# EAGLE design Suport 0.1 (EAGLE 9.6.2)
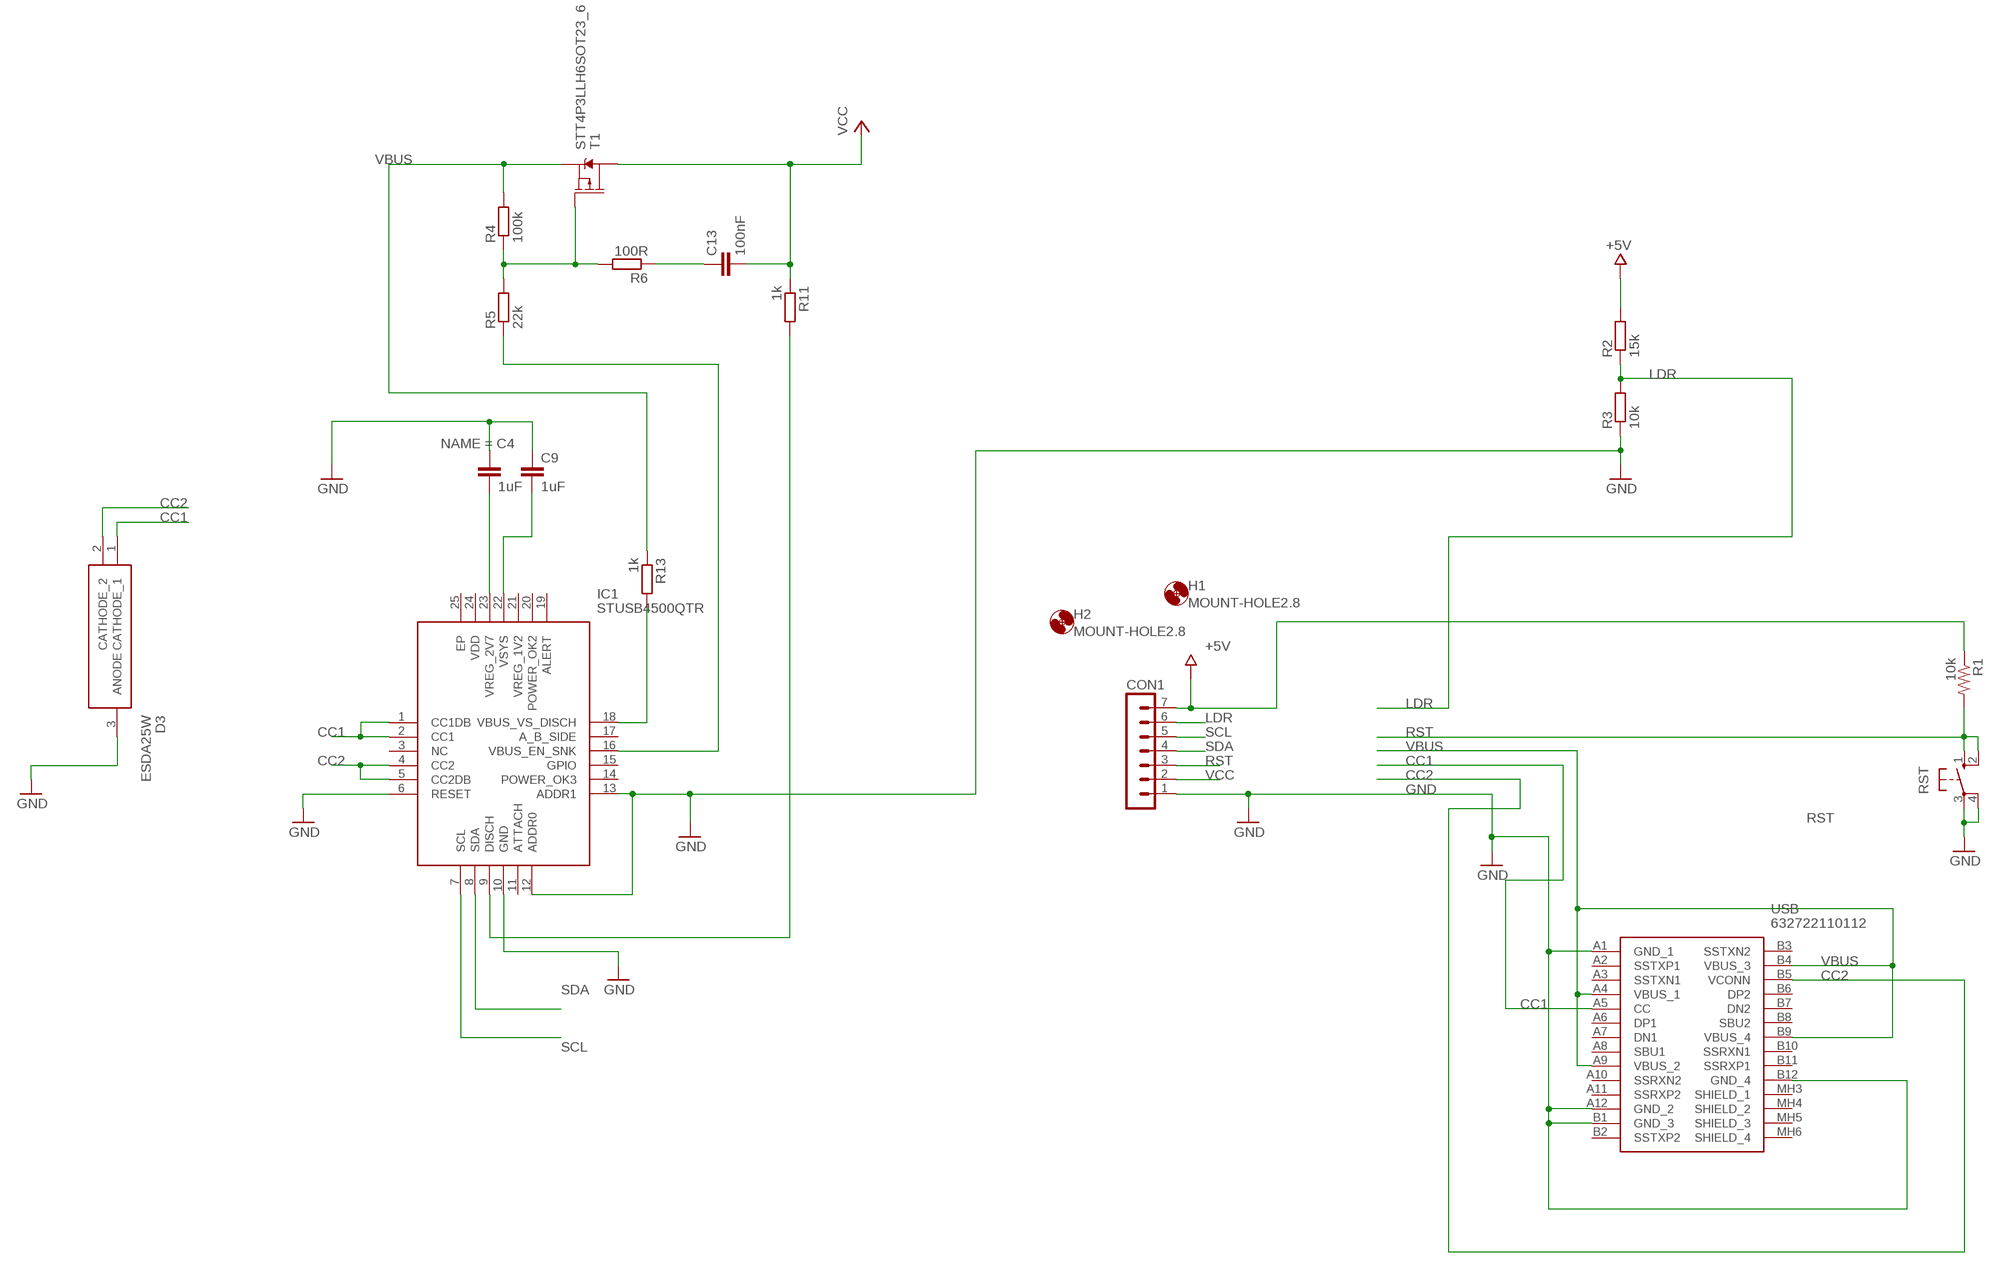
[diagram p0: schematic, sheet 1]

## Parts
C4  1uF  C-EUC0603  [C0603]
C9  1uF  C-EUC0603  [C0603]
C13  100nF  C-EUC0402  [C0402]
CON1  MA07-1  [MA07-1]
D3  ESDA25W  [SOT65P210X110-3N]
H1  MOUNT-HOLE2.8  [2,8]
H2  MOUNT-HOLE2.8  [2,8]
IC1  STUSB4500QTR  [QFN50P400X400X100-25N]
R1  10k  R-US_M2012  [M2012]
R2  15k  R-EU_0204/2V  [0204V]
R3  10k  R-EU_M2012  [M2012]
R4  100k  R-EU_R0805  [R0805]
R5  22k  R-EU_R0805  [R0805]
R6  100R  R-EU_R0805  [R0805]
R11  1k  R-EU_R0805  [R0805]
R13  1k  R-EU_R0805  [R0805]
RST  10-XX  [B3F-10XX]
T1  STT4P3LLH6SOT23_6  [SOT23-6]
USB  632722110112  [632722110112]

## Nets
+5V [pwr]: CON1.7 R1.1 R2.2
CC1: D3.1(CATHODE_1) IC1.1(CC1DB) IC1.2(CC1) USB.A5(CC)
CC2: D3.2(CATHODE_2) IC1.4(CC2) IC1.5(CC2DB) USB.B5(VCONN)
GND: C4.1 C9.1 CON1.1 D3.3(ANODE) IC1.6(RESET) IC1.10(GND) IC1.12(ADDR0) IC1.13(ADDR1) R3.1 RST.3(P) RST.4(P1) USB.A1(GND_1) USB.A12(GND_2) USB.B1(GND_3) USB.B12(GND_4)
LDR: CON1.6 R2.1 R3.2
N$1: C4.2 IC1.23(VREG_2V7)
N$2: C9.2 IC1.22(VSYS)
N$11: R4.1 R5.2 R6.2 T1.3(G)
N$13: C13.1 R6.1
N$17: IC1.16(VBUS_EN_SNK) R5.1
N$21: IC1.9(DISCH) R11.2
N$22: IC1.18(VBUS_VS_DISCH) R13.2
RST: CON1.3 R1.2 RST.1(S) RST.2(S1)
SCL: CON1.5 IC1.7(SCL)
SDA: CON1.4 IC1.8(SDA)
VBUS: R4.2 R13.1 T1.4(S) USB.A4(VBUS_1) USB.A9(VBUS_2) USB.B4(VBUS_3) USB.B9(VBUS_4)
VCC [pwr]: C13.2 CON1.2 R11.1 T1.1(D) T1.2(D) T1.5(D) T1.6(D)
Unconnected: IC1.3(NC) IC1.11(ATTACH) IC1.14(POWER_OK3) IC1.15(GPIO) IC1.17(A_B_SIDE) IC1.19(ALERT) IC1.20(POWER_OK2) IC1.21(VREG_1V2) IC1.24(VDD) IC1.25(EP) USB.A2(SSTXP1) USB.A3(SSTXN1) USB.A6(DP1) USB.A7(DN1) USB.A8(SBU1) USB.A10(SSRXN2) USB.A11(SSRXP2) USB.B2(SSTXP2) USB.B3(SSTXN2) USB.B6(DP2) USB.B7(DN2) USB.B8(SBU2) USB.B10(SSRXN1) USB.B11(SSRXP1) USB.MH3(SHIELD_1) USB.MH4(SHIELD_2) USB.MH5(SHIELD_3) USB.MH6(SHIELD_4)

## Library data of the parts
C4 = rcl:C-EU: CAPACITOR, European symbol; MOUSER_PART_NUMBER: 81-GRM155R61E105KA2D; SPICEPREFIX: C
C9 = rcl:C-EU: CAPACITOR, European symbol; SPICEPREFIX: C
C13 = rcl:C-EU: CAPACITOR, European symbol; MOUSER_PART_NUMBER: 710-885012205050; SPICEPREFIX: C
CON1 = con-lstb:MA07-1: PIN HEADER; OC_FARNELL: unknown; OC_NEWARK: unknown
D3 = SamacSys_Parts:ESDA25W: STMicroelectronics ESDA25W Dual Uni-Directional TVS Diode Array, 400W peak, 3-Pin SOT-323 Source: Datasheet <https://componentsearchengine.com/Datasheets/1/ESDA25W.pdf>; DESCRIPTION: STMicroelectronics ESDA25W Dual Uni-Directional TVS Diode Array, 400W peak, 3-Pin SOT-323; HEIGHT: 1.1mm; MANUFACTURER_NAME: STMicroelectronics; MANUFACTURER_PART_NUMBER: ESDA25W; MOUSER_PART_NUMBER: 511-ESDA25W; MOUSER_PRICE-STOCK: https://www.mouser.com/Search/Refine.aspx?Keyword=511-ESDA25W
H1 H2 = holes:MOUNT-HOLE: MOUNTING HOLE with drill center marker
IC1 = SamacSys_Parts:STUSB4500QTR: USB Interface IC CONDITIONING & INTERFACES Source: Datasheet <https://componentsearchengine.com/Datasheets/1/STUSB4500QTR.pdf>; DESCRIPTION: USB Interface IC CONDITIONING & INTERFACES; HEIGHT: 1mm; MANUFACTURER_NAME: STMicroelectronics; MANUFACTURER_PART_NUMBER: STUSB4500QTR; MOUSER_PART_NUMBER: 511-STUSB4500QTR; MOUSER_PRICE-STOCK: https://www.mouser.com/Search/Refine.aspx?Keyword=511-STUSB4500QTR
R1 = adafruit:R-US_: RESISTOR, American symbol
R2 R3 = resistor:R-EU_: RESISTOR, European symbol
R4-R6 R11 R13 = rcl:R-EU_: RESISTOR, European symbol; SPICEPREFIX: R
RST = switch-omron:10-XX: OMRON SWITCH; MPN: B3F-1000; OC_FARNELL: 176432; OC_NEWARK: 36M3542
T1 = STT4P3LLH6:STT4P3LLH6; AVAILABILITY: Unavailable; DESCRIPTION: P-Channel 30 V, 0.048 Ohm typ., 4 A STripFET H6 Power MOSFET in a SOT23-6L package; MF: STMicroelectronics; MP: STT4P3LLH6; PACKAGE: SOT-23-6 STMicroelectronics; PRICE: None
USB = SamacSys_Parts:632722110112: USB Connectors WR-COM SMT Vertical Black Source: Datasheet; DESCRIPTION: USB Connectors WR-COM SMT Vertical Black; HEIGHT: 7.4mm; MANUFACTURER_NAME: Wurth Elektronik; MANUFACTURER_PART_NUMBER: 632722110112; MOUSER_PART_NUMBER: 710-632722110112; MOUSER_PRICE-STOCK: https://www.mouser.co.uk/ProductDetail/Wurth-Elektronik/632722110112?qs=2WXlatMagcH6zbfYjgLonA%3D%3D

## Module TUBEIN16
Ports: 

### Library data of the parts

## Net classes
0 default: width 0.254 mm, clearance 0.254 mm
1 pwr: width 0.254 mm, clearance 0.205 mm to class 0, clearance 0.356 mm

## Board
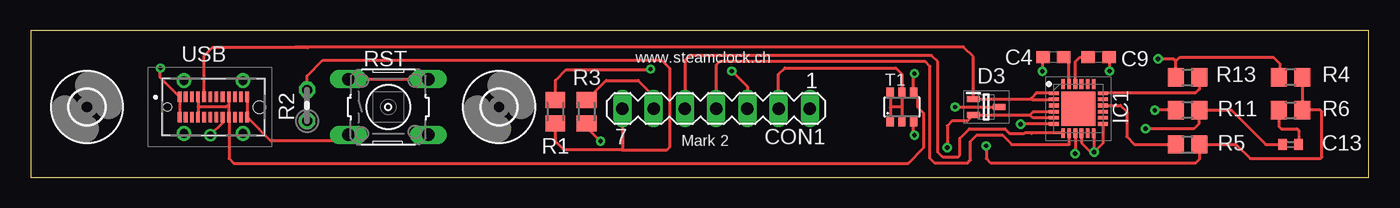
[diagram p1: board, top side]
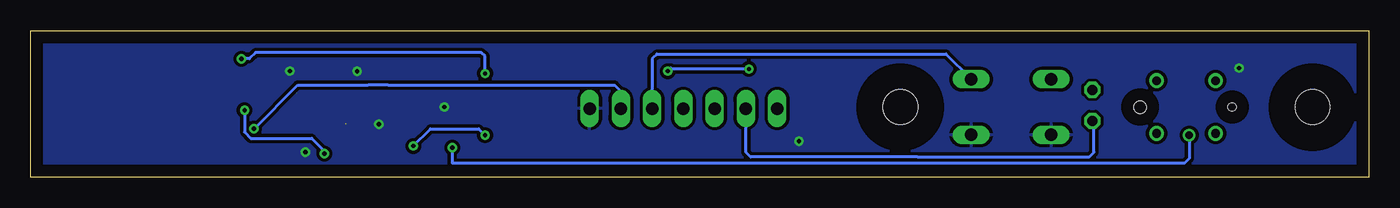
[diagram p2: board, bottom side, seen from below]

Size 108.84 x 11.94 mm. Coordinates in mm from the lower left corner, seen from the top.
Outline: 0,11.94 0,0 108.84,0 108.84,11.94 0,11.94
Copper layers (1*16): Top 0.035mm / dielectric 1.5mm / Bottom 0.035mm
Design rules "default *": minimum track width 6mil, minimum drill 0.35mm, track to track 4mil, track to pad 6mil, pad to pad 6mil, via to via 6mil, smd to smd 6mil, copper to edge 40mil, drill to drill 6mil, minimum pad ring 10mil, minimum via ring 8mil, stop-mask expansion 4mil, vias tented up to drill 0mil, thermal gap 10mil

### Footprints (pad centres in the part's own frame; a part is rotated, then mirrored left to right if it is on the bottom)
C0603 = smd 1.1 x 1: 1 -0.85,0; 2 0.85,0
C0402 = smd 0.7 x 0.9: 1 -0.65,0; 2 0.65,0
MA07-1 = drill 1.016 long: 1 -7.62,0; 2 -5.08,0; 3 -2.54,0; 4 0,0; 5 2.54,0; 6 5.08,0; 7 7.62,0
SOT65P210X110-3N = smd 1.05 x 0.5: 1 -1.05,0.65; 2 -1.05,-0.65; 3 1.05,0
2,8 = hole 2.8: 0,0
QFN50P400X400X100-25N = smd 0.8 x 0.3: 1 -2,1.25; 2 -2,0.75; 3 -2,0.25; 4 -2,-0.25; 5 -2,-0.75; 6 -2,-1.25; 13 2,-1.25; 14 2,-0.75; 15 2,-0.25; 16 2,0.25; 17 2,0.75; 18 2,1.25 | smd 0.3 x 0.8: 7 -1.25,-2; 8 -0.75,-2; 9 -0.25,-2; 10 0.25,-2; 11 0.75,-2; 12 1.25,-2; 19 1.25,2; 20 0.75,2; 21 0.25,2; 22 -0.25,2; 23 -0.75,2; 24 -1.25,2 | smd 2.8 x 2.8: 25 0,0
M2012 = smd 1.3 x 1.6: 1 -0.95,0; 2 0.95,0
0204V = drill 0.813 octagon: 1 -1.27,0; 2 1.27,0
R0805 = smd 1.3 x 1.5: 1 -0.95,0; 2 0.95,0
B3F-10XX = drill 1.016 long: 1 -3.251,2.261; 2 3.251,2.261; 3 -3.251,-2.261; 4 3.251,-2.261
SOT23-6 = smd 0.6 x 0.9: 1 -0.95,-1.15; 2 0,-1.15; 3 0.95,-1.15; 4 0.95,1.15; 5 0,1.15; 6 -0.95,1.15
632722110112 = smd 0.3 x 0.85: A1 -2.75,0.83; A2 -2.25,0.83; A3 -1.75,0.83; A4 -1.25,0.83; A5 -0.75,0.83; A6 -0.25,0.83; A7 0.25,0.83; A8 0.75,0.83; A9 1.25,0.83; A10 1.75,0.83; A11 2.25,0.83; A12 2.75,0.83; B1 2.75,-0.83; B2 2.25,-0.83; B3 1.75,-0.83; B4 1.25,-0.83; B5 0.75,-0.83; B6 0.25,-0.83; B7 -0.25,-0.83; B8 -0.75,-0.83; B9 -1.25,-0.83; B10 -1.75,-0.83; B11 -2.25,-0.83; B12 -2.75,-0.83 | drill 0.7 pad 1.2: MH3 -2.4,2.15; MH4 2.4,2.15; MH5 -2.4,-2.15; MH6 2.4,-2.15 | hole 0.66: -3.75,0 | hole 1: 3.75,0

### Placement (x,y rotation side)
C4  83.19,9.78 0 top
C9  86.87,9.78 180 top
C13  102.49,2.67 180 top
CON1  55.75,5.59 180 top
D3  77.72,5.71 0 top
H1  4.57,5.71 0 top
H2  38.1,5.71 0 top
IC1  85.22,5.59 0 top
R1  42.67,5.33 90 top
R2  22.48,5.84 90 top
R3  45.21,5.33 90 top
R4  102.49,8.13 180 top
R5  94.11,2.67 0 top
R6  102.49,5.46 0 top
R11  94.11,5.46 180 top
R13  94.11,8.13 0 top
RST  29.08,5.71 0 top
T1  70.87,5.71 0 top
USB  14.86,5.71 0 top

### Tracks (layer width: path | path; a pad name or v marks a point on that pad's centre or on a via)
+5V
  Top 0.254: 42.29,4.76 R1.1 | R1.1 42.55,4.26 | R2.2 22.48,8.25 23.75,9.52 51.31,9.52 51.94,8.89 51.94,2.41 51.74,2.21 48.13,2.21 | R1.1 42.67,2.92 43.38,2.21 48.13,2.21 | CON1.7 48.13,2.21
CC1
  Top 0.254: IC1.1 81.81,6.84 | 81.81,6.84 81.79,6.86 | IC1.2 81.42,6.34 81.39,6.36 | 81.39,6.36 D3.1 76.67,9.81 75.88,10.6 22.61,10.6 | 81.81,6.84 81.39,6.42 81.39,6.36 | 22.61,10.6 21.53,10.6 | 22.61,10.6 22.54,10.54 14.74,10.54 14.11,9.91 USB.A5
CC2  (via drill 0.35, 0.61)
  Top 0.254: USB.B5 15.61,4.43 v14.61,3.43 | IC1.4 81.54,5.34 81.28,5.08 | IC1.5 81.55,4.84 | 81.55,4.84 81.53,4.83 | 81.28,5.08 76.69,5.08 D3.2 76.18,4.57 74.93,4.57 74.55,4.19 v74.55,2.41 | 81.55,4.84 81.53,4.84 81.28,5.08
  Bottom 0.254: v14.61,3.43 14.61,1.52 14.99,1.14 74.55,1.14 v74.55,2.41
GND  (via drill 0.35)  (1 unrouted)
  Top 0.254: USB.B1 17.61,4.6 | 17.61,6.83 USB.A12 USB.B1 | 12.11,4.74 USB.B12 USB.A1 10.54,8.11 v10.54,8.89 | USB.B1 18.54,3.95 18.54,3.94 19.53,2.95 25.32,2.95 RST.3 | 83.2,4.32 v80.52,4.32 | C4.1 82.3,9.74 v82.3,8.64 | v87.76,8.64 87.72,8.68 C9.1 | v75.18,5.71 D3.3 | IC1.10 85.47,2.79 86.23,2.03 v86.49,2.03 | IC1.12 86.49,3.57 v86.49,2.03 | IC1.13 87.22,2.76 v86.49,2.03 | R3.1 45.21,4.06 v46.36,2.92
  Bottom 0.254: v80.52,4.32
  pour Bottom: -8.13,12.7 -8.13,-0.76 108.59,-0.76 108.59,12.7
LDR
  Top 0.254: R3.2 46.8,7.87 49.4,7.87 50.67,6.6 CON1.6
  Bottom 0.254: CON1.6 50.67,2.03 50.29,1.65 36.7,1.65 22.73,1.65 22.35,2.03 22.35,4.44 R2.1
N$1
  Top 0.254: IC1.23 84.45,7.6 84.45,9.36 C4.2
N$2
  Top 0.254: IC1.22 84.97,9.4 85.34,9.78 C9.2
N$11  (via drill 0.35)
  Top 0.254: R4.1 R6.2 104.9,5.46 105.03,5.33 105.03,1.65 104.9,1.52 99.19,1.52 98.04,2.67 R5.2 95.06,1.46 94.74,1.14 78.11,1.14 77.72,1.52 v77.72,2.54 | v71.88,3.43 71.82,3.49 T1.3
  Bottom 0.254: v77.72,2.54 76.33,3.94 72.39,3.94 v71.88,3.43
N$13
  Top 0.254: R6.1 101.54,4.12 101.73,3.94 103,3.94 103.14,3.79 C13.1
N$17
  Top 0.254: R5.1 89.79,2.67 89.15,3.3 89.15,5.33 88.65,5.84 IC1.16
N$21  (via drill 0.35)
  Top 0.254: R11.2 v91.44,5.46 | IC1.9 v84.97,1.9 v84.96,1.9
  Bottom 0.254: v84.96,1.9 84.96,2.16 85.98,3.17 90.93,3.17 91.44,3.68 v91.44,5.46
N$22  (1 unrouted)
  Top 0.254: R13.2 95.06,7.17 94.74,6.86 87.79,6.86 87.78,6.87 87.22,6.87
RST  (via drill 0.35)
  Top 0.254: RST.1 RST.2 | R1.2 42.67,7.87 43.56,8.76 50.42,8.76 v50.42,8.81 | v57.02,8.64 58.29,7.37 CON1.3
  Bottom 0.254: RST.2 34.39,10.03 57.91,10.03 58.29,9.65 CON1.3 | v50.42,8.81 56.69,8.81 56.77,8.89 v57.02,8.64
SCL
  Top 0.254: IC1.7 81.44,3.59 | 81.44,3.59 81.41,3.56 | 81.44,3.59 80.86,3.59 80.83,3.57 79.62,3.57 79.25,3.94 76.34,3.94 75.56,3.16 75.56,1.78 75.44,1.65 74.17,1.65 73.79,2.03 73.79,9.4 73.28,9.91 53.59,9.91 53.21,9.52 CON1.5
SDA
  Top 0.254: IC1.8 84.45,3.58 84.45,2.67 79.8,2.67 79.04,3.43 76.96,3.43 76.45,2.92 76.45,1.4 76.2,1.14 73.53,1.14 73.15,1.52 73.15,9.02 72.77,9.4 56.01,9.4 55.75,9.14 CON1.4
VBUS  (via drill 0.35)
  Top 0.254: USB.A4 13.61,5.71 | 13.61,5.71 USB.B9 | USB.A9 16.11,5.84 | 16.11,5.84 USB.B4 16.13,4.86 16.13,1.52 16.51,1.14 71.37,1.14 72.64,2.41 72.64,5.21 72.13,5.72 72.13,6.55 T1.4 71.82,8.45 v71.88,8.45 | 16.11,5.84 16.02,5.84 15.92,5.74 13.63,5.74 13.61,5.71 | R13.1 93.16,9.46 | 93.16,9.46 93.47,9.78 101.09,9.78 101.6,9.27 101.6,8.19 R4.2 | v91.69,9.65 92.97,9.65 93.16,9.46
  Bottom 0.254: v71.88,8.45 71.88,9.84 72.2,10.16 90.55,10.16 91.06,9.65 v91.69,9.65
VCC  (via drill 0.35)
  Top 0.254: 70.87,5.71 T1.5 70.87,8.38 70.36,8.89 61.34,8.89 60.83,8.38 CON1.2 60.83,6.35 | 70.87,5.71 T1.2 | T1.6 69.92,5.71 | 69.92,5.71 T1.1 | 70.87,5.71 69.92,5.71 | C13.2 100.46,2.67 97.66,5.46 R11.1 95,5.4 95,4.32 94.62,3.94 v90.68,3.94
  Bottom 0.254: CON1.2 60.83,6.98 61.34,7.49 79.76,7.49 81.41,7.49 87.12,7.49 v90.68,3.94

### Text on the board
tNames: www.steamclock.ch | Mark 2